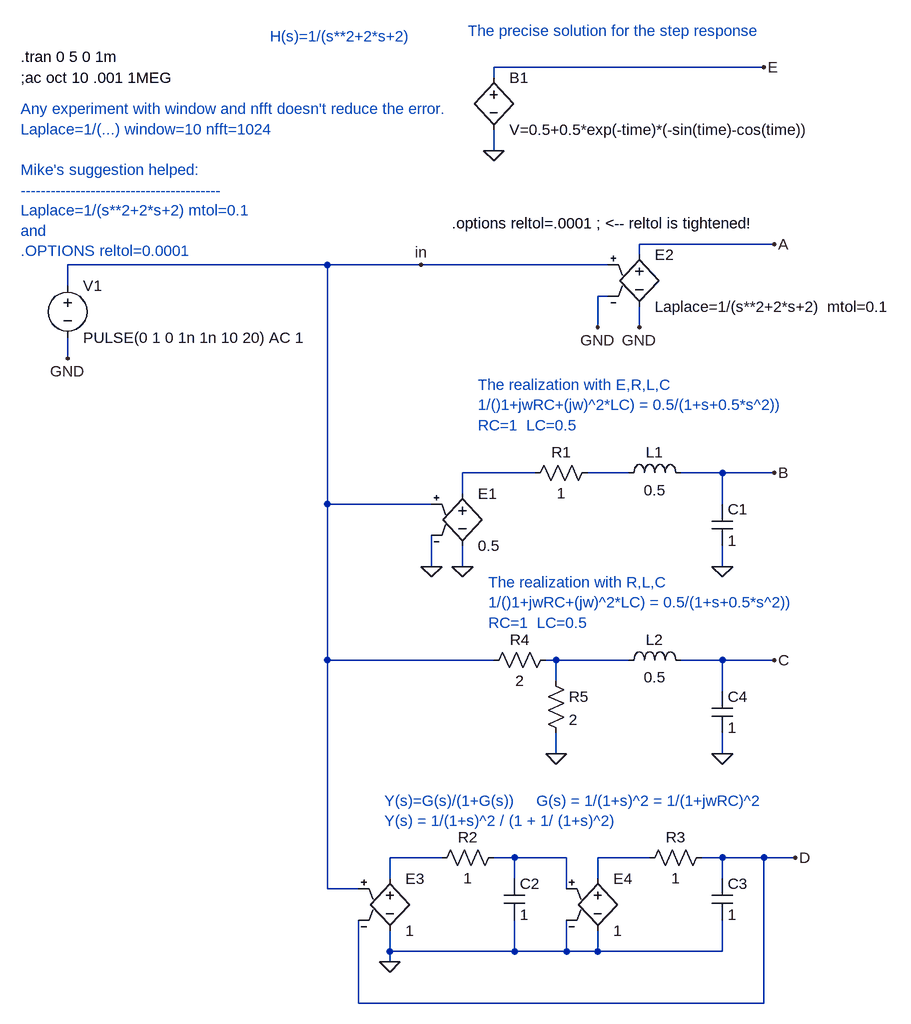
[diagram p0: schematic Laplace1.asc]
Laplace1.asc, the LTspice schematic file:
Version 4
SHEET 1 2040 1700
WIRE 176 320 576 320
WIRE 176 352 176 320
WIRE 176 432 176 464
WIRE 1056 288 1264 288
WIRE 1056 304 1056 288
WIRE 1056 384 1056 416
WIRE 1008 368 992 368
WIRE 992 368 992 416
WIRE 976 640 1040 640
WIRE 1120 640 1184 640
WIRE 1184 640 1184 688
WIRE 896 640 784 640
WIRE 576 320 720 320
WIRE 1184 752 1184 784
WIRE 1184 640 1264 640
WIRE 736 736 736 784
WIRE 784 752 784 784
WIRE 784 672 784 640
WIRE 832 112 832 144
WIRE 832 32 832 16
WIRE 832 16 1248 16
WIRE 832 1232 864 1232
WIRE 864 1232 864 1264
WIRE 944 1280 944 1232
WIRE 944 1232 864 1232
WIRE 992 1264 992 1232
WIRE 992 1232 1072 1232
WIRE 1152 1232 1184 1232
WIRE 1184 1232 1184 1264
WIRE 992 1344 992 1376
WIRE 992 1376 944 1376
WIRE 672 1376 672 1344
WIRE 672 1264 672 1232
WIRE 672 1232 752 1232
WIRE 864 1328 864 1376
WIRE 864 1376 672 1376
WIRE 992 1376 1184 1376
WIRE 1184 1376 1184 1328
WIRE 944 1328 944 1376
WIRE 944 1376 864 1376
WIRE 624 1280 576 1280
WIRE 624 1328 624 1456
WIRE 624 1456 1248 1456
WIRE 1248 1456 1248 1232
WIRE 1248 1232 1184 1232
WIRE 672 1392 672 1376
WIRE 1248 1232 1296 1232
WIRE 912 928 928 928
WIRE 1120 928 1184 928
WIRE 1184 928 1184 976
WIRE 832 928 576 928
WIRE 1184 1040 1184 1072
WIRE 1184 928 1264 928
WIRE 928 960 928 928
WIRE 928 928 1040 928
WIRE 928 1040 928 1072
WIRE 576 928 576 688
WIRE 736 688 576 688
WIRE 576 688 576 320
WIRE 720 320 1008 320
WIRE 576 928 576 1280
FLAG 176 464 GND
FLAG 1264 288 A
FLAG 1056 416 GND
FLAG 992 416 GND
FLAG 1184 784 0
FLAG 1264 640 B
FLAG 736 784 0
FLAG 784 784 0
FLAG 1248 16 E
FLAG 832 144 0
FLAG 720 320 in
FLAG 1296 1232 D
FLAG 672 1392 0
FLAG 1184 1072 0
FLAG 1264 928 C
FLAG 928 1072 0
SYMBOL VOLTAGE 176 336 R0
SYMATTR InstName V1
SYMATTR Value PULSE(0 1 0 1n 1n 10 20) AC 1
SYMBOL E 1056 288 R0
WINDOW 123 24 132 Left 0
SYMATTR InstName E2
SYMATTR Value Laplace=1/(s**2+2*s+2)  mtol=0.1
SYMBOL res 880 656 R270
WINDOW 0 32 56 VTop 0
WINDOW 3 0 56 VBottom 0
SYMATTR InstName R1
SYMATTR Value 1
SYMBOL ind 1024 656 R270
WINDOW 0 32 56 VTop 0
WINDOW 3 5 56 VBottom 0
SYMATTR InstName L1
SYMATTR Value 0.5
SYMBOL cap 1168 688 R0
SYMATTR InstName C1
SYMATTR Value 1
SYMBOL e 784 656 R0
SYMATTR InstName E1
SYMATTR Value 0.5
SYMBOL bv 832 16 R0
SYMATTR InstName B1
SYMATTR Value V=0.5+0.5*exp(-time)*(-sin(time)-cos(time))
SYMBOL e 672 1248 R0
SYMATTR InstName E3
SYMATTR Value 1
SYMBOL e 992 1248 R0
SYMATTR InstName E4
SYMATTR Value 1
SYMBOL cap 848 1264 R0
SYMATTR InstName C2
SYMATTR Value 1
SYMBOL cap 1168 1264 R0
SYMATTR InstName C3
SYMATTR Value 1
SYMBOL res 736 1248 R270
WINDOW 0 32 56 VTop 0
WINDOW 3 0 56 VBottom 0
SYMATTR InstName R2
SYMATTR Value 1
SYMBOL res 1056 1248 R270
WINDOW 0 32 56 VTop 0
WINDOW 3 0 56 VBottom 0
SYMATTR InstName R3
SYMATTR Value 1
SYMBOL res 816 944 R270
WINDOW 0 32 56 VTop 0
WINDOW 3 0 56 VBottom 0
SYMATTR InstName R4
SYMATTR Value 2
SYMBOL ind 1024 944 R270
WINDOW 0 32 56 VTop 0
WINDOW 3 5 56 VBottom 0
SYMATTR InstName L2
SYMATTR Value 0.5
SYMBOL cap 1168 976 R0
SYMATTR InstName C4
SYMATTR Value 1
SYMBOL res 912 944 R0
SYMATTR InstName R5
SYMATTR Value 2
TEXT 104 32 Left 0 !;ac oct 10 .001 1MEG
TEXT 104 0 Left 0 !.tran 0 5 0 1m
TEXT 104 80 Left 0 ;Any experiment with window and nfft doesn't reduce the error.\nLaplace=1/(...) window=10 nfft=1024\n \nMike's suggestion helped: \n----------------------------------------\nLaplace=1/(s**2+2*s+2) mtol=0.1\nand \n.OPTIONS reltol=0.0001
TEXT 808 504 Left 0 ;The realization with E,R,L,C\n1/()1+jwRC+(jw)^2*LC) = 0.5/(1+s+0.5*s^2))\nRC=1  LC=0.5
TEXT 792 -40 Left 0 ;The precise solution for the step response
TEXT 664 1144 Left 0 ;Y(s)=G(s)/(1+G(s))     G(s) = 1/(1+s)^2 = 1/(1+jwRC)^2\nY(s) = 1/(1+s)^2 / (1 + 1/ (1+s)^2)
TEXT 488 -32 Left 0 ;H(s)=1/(s**2+2*s+2)
TEXT 768 256 Left 0 !.options reltol=.0001 ; <-- reltol is tightened!
TEXT 824 808 Left 0 ;The realization with R,L,C\n1/()1+jwRC+(jw)^2*LC) = 0.5/(1+s+0.5*s^2))\nRC=1  LC=0.5

The netlist it stands for:
* Laplace1.asc
V1 in GND PULSE(0 1 0 1n 1n 10 20) AC 1
E2 A GND in GND Laplace=1/(s**2+2*s+2)  mtol=0.1
R1 N002 N001 1
L1 N001 B 0.5
C1 B 0 1
E1 N002 0 in 0 0.5
B1 E 0 V=0.5+0.5*exp(-time)*(-sin(time)-cos(time))
E3 N005 0 in D 1
E4 N004 0 N003 0 1
C2 N003 0 1
C3 D 0 1
R2 N005 N003 1
R3 N004 D 1
R4 in N006 2
L2 N006 C 0.5
C4 C 0 1
R5 N006 0 2
;ac oct 10 .001 1MEG
.tran 0 5 0 1m
* Any experiment with window and nfft doesn't reduce the error.
* Laplace=1/(...) window=10 nfft=1024
* Mike's suggestion helped:
* ----------------------------------------
* Laplace=1/(s**2+2*s+2) mtol=0.1
* and
* .OPTIONS reltol=0.0001
* The realization with E,R,L,C
* 1/()1+jwRC+(jw)^2*LC) = 0.5/(1+s+0.5*s^2))
* RC=1  LC=0.5
* The precise solution for the step response
* Y(s)=G(s)/(1+G(s))     G(s) = 1/(1+s)^2 = 1/(1+jwRC)^2
* Y(s) = 1/(1+s)^2 / (1 + 1/ (1+s)^2)
* H(s)=1/(s**2+2*s+2)
.options reltol=.0001 ; <-- reltol is tightened!
* The realization with R,L,C
* 1/()1+jwRC+(jw)^2*LC) = 0.5/(1+s+0.5*s^2))
* RC=1  LC=0.5
.backanno
.end